# EAGLE design Servant (EAGLE 8.2.2)
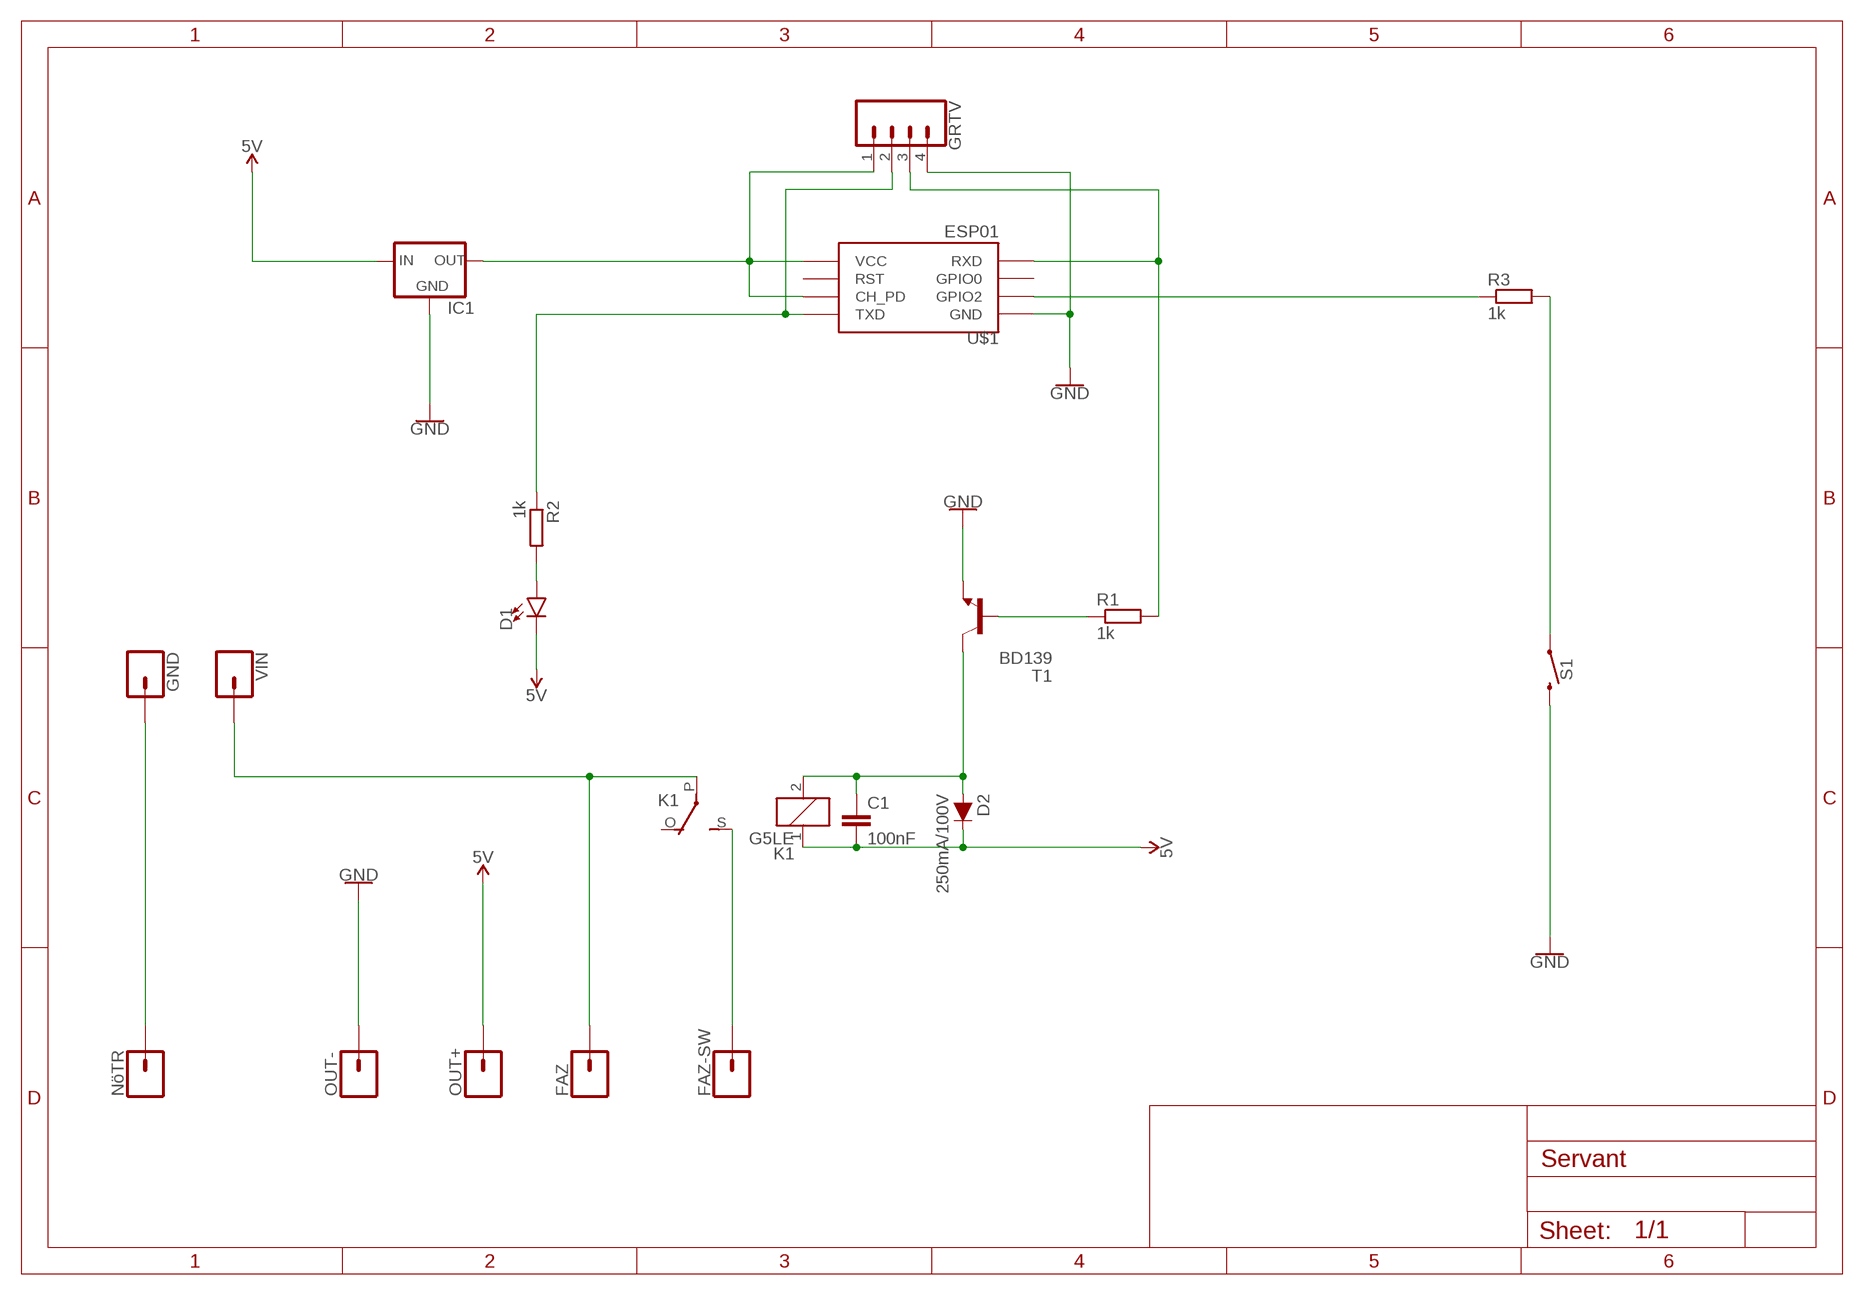
[diagram p0: schematic, sheet 1]

## Parts
C1  100nF  22UF-0805-6.3V-20%  [0805]
D1  LED-3MM-NO_SILK  [LED_3MM-NS]
D2  250mA/100V  DIODE-BAS16J  [SOD-323]
FAZ  CONN_01PTH_LONGPAD  [1X01_LONGPAD]
FAZ-SW  CONN_01PTH_LONGPAD  [1X01_LONGPAD]
GND  CONN_01  [1X01]
GRTV  CONN_041X04_NO_SILK  [1X04_NO_SILK]
IC1  XC63FPM  [SOT23]
K1  G5LE  [G5LE]
NöTR  CONN_01PTH_LONGPAD  [1X01_LONGPAD]
OUT+  CONN_01  [1X01]
OUT-  CONN_01  [1X01]
R1  1k  R-EU_R1206  [R1206]
R2  1k  R-EU_R1206  [R1206]
R3  1k  R-EU_R1206  [R1206]
S1  MOMENTARY-SWITCH-SPST-PTH-6.0MM  [TACTILE_SWITCH_PTH_6.0MM]
T1  BD139  -NPN-TO126V  [TO126V]
U$1  ESP01  [ESP01]
VIN  CONN_01  [1X01]

## Nets
5V: C1.2 D1.K(C) D2.C IC1.3(IN) K1.1 OUT+.1
GND: GRTV.4 IC1.1(GND) OUT-.1 S1.3 T1.1(E) U$1.GND
N$1: GRTV.1 IC1.2(OUT) U$1.CH_PD U$1.VCC
N$2: C1.1 D2.A K1.2 T1.2(C)
N$3: R1.1 T1.3(B)
N$4 [power]: FAZ.1 K1.P(2:P) VIN.1
N$5 [power]: FAZ-SW.1 K1.S(2:S)
N$6: GRTV.3 R1.2 U$1.RX(RXD)
N$7: D1.A R2.2
N$8: GRTV.2 R2.1 U$1.TX(TXD)
N$9 [power]: GND.1 NöTR.1
N$10: R3.1 U$1.GPIO2
N$11: R3.2 S1.1
Unconnected: K1.O(2:O) U$1.GPIO0 U$1.RST

## Library data of the parts
C1 = SparkFun-Capacitors:22UF: 22µF ceramic capacitors A capacitor is a passive two-terminal electrical component used to store electrical energy temporarily in an electric field.; PROD_ID: CAP-08402; VALUE: 22uF
D1 = SparkFun-LED:LED: LED (Generic) Standard schematic elements and footprints for 5mm, 3mm, 1206, and 0603 sized LEDs. Generic LEDs with no color specified.
D2 = SparkFun-DiscreteSemi:DIODE: Diode These are standard reverse protection diodes and small signal diodes. SparkFun Products: SparkFun SparkPunk Sound Kit <https://www.sparkfun.com/products/11177> SparkFun ESP8266 Thing <https://www.sparkfun.com/products/13231>; PROD_ID: DIO-09646
FAZ FAZ-SW GND NöTR OUT+ OUT- VIN = SparkFun-Connectors:CONN_01: Single connection point. Often used as Generic Header-pin footprint for 0.1 inch spaced/style header connections On any of the 0.1 inch spaced packages, you can populate with these: Break Away Headers - Straight <https://www.sparkfun.com/products/116> (PRT-00116) Break Away Male Headers - Right Angle <https://www.sparkfun.com/products/553> (PRT-00553) Female Headers <https://www.sparkfun.com/products/115> (PRT-00115) Break Away Headers - Machine Pin <https://www.sparkfun.com/products/117> (PRT-00117) Break Away Female Headers - Swiss Machine Pin <https://www.sparkfun.com/products/743> (PRT-00743) This device is also useful as a general connection point to wire up your design to another part of your project. Our various solder wires solder well into these plated through hole pads. Hook-Up Wire - Assortment (Stranded, 22 AWG) <https://www.sparkfun.com/products/11375> (PRT-11375) Hook-Up Wire - Assortment (Solid Core, 22 AWG) <https://www.sparkfun.com/products/11367> (PRT-11367) View the entire wire category on our website here <https://www.sparkfun.com/categories/141> Special notes: SMTSO-256-ET is a "flush mount" nut for a 4-40 screw. We mostly use this on specialty testbeds; it is a nice way to connect hardware to your PCB at an adjustable hieght. Also note, the SNAP packages are for using a snappable style connector. We sell a baggie of snaps and they are also used on two LilyPad designs: Snap Assortment - 30 pack (male and female) <https://www.sparkfun.com/products/11347> (DEV-11347) LilyPad Arduino SimpleSnap <https://www.sparkfun.com/products/10941> (DEV-10941) LilyPad SimpleSnap Protoboard <https://www.sparkfun.com/products/10940> (DEV-10940)
GRTV = SparkFun-Connectors:CONN_04: Multi connection point. Often used as Generic Header-pin footprint for 0.1 inch spaced/style header connections On any of the 0.1 inch spaced packages, you can populate with these: Break Away Headers - Straight <https://www.sparkfun.com/products/116> (PRT-00116) Break Away Male Headers - Right Angle <https://www.sparkfun.com/products/553> (PRT-00553) Female Headers <https://www.sparkfun.com/products/115> (PRT-00115) Break Away Headers - Machine Pin <https://www.sparkfun.com/products/117> (PRT-00117) Break Away Female Headers - Swiss Machine Pin <https://www.sparkfun.com/products/743> (PRT-00743) For SCREWTERMINALS and SPRING TERMINALS visit here: Screw Terimnals on SparkFun.com <https://www.sparkfun.com/search/results?term=Screw+Terminals> (5mm/3.5mm/2.54mm spacing) This device is also useful as a general connection point to wire up your design to another part of your project. Our various solder wires solder well into these plated through hole pads. Hook-Up Wire - Assortment (Stranded, 22 AWG) <https://www.sparkfun.com/products/11375> (PRT-11375) Hook-Up Wire - Assortment (Solid Core, 22 AWG) <https://www.sparkfun.com/products/11367> (PRT-11367) View the entire wire category on our website here <https://www.sparkfun.com/categories/141> Special notes: Molex polarized connector foot print use with SKU : PRT-08231 with associated crimp pins and housings. 1MM SMD Version SKU: PRT-10208; PROD_ID: CONN-09696
IC1 = v-reg:XC63FP: Positiv Voltage Regulators www.torex.co.jp/english/product/pro02/pdf/0201_xc62fp.pdf
K1 = relay:G5LE: RELAY 1 x switch, 10 A/120 V AC, 8 A/30 V DC, Omron; OC_FARNELL: unknown; OC_NEWARK: unknown
R1-R3 = resistor:R-EU_: RESISTOR, European symbol
S1 = SparkFun-Switches:MOMENTARY-SWITCH-SPST: Momentary Switch (Pushbutton) - SPST Normally-open (NO) SPST momentary switches (buttons, pushbuttons). Variants PTH-12MM - 12mm square, through-hole Momentary Pushbutton Switch - 12mm Square <https://www.sparkfun.com/products/9190> (COM-09190) PTH-6.0MM, PTH-6.0MM-KIT - 6.0mm square, through-hole Mini Pushbutton Switch <https://www.sparkfun.com/products/97> (COM-00097) KIT package intended for soldering kit's - only one side of pads' copper is exposed. PTH-RIGHT-ANGLE-KIT - Right-angle, through-hole Right Angle Tactile Button <https://www.sparkfun.com/products/10791> - Used on SparkFun BigTime Watch Kit <https://www.sparkfun.com/products/11734> SMD-12MM - 12mm square, surface-mount Tactile Button - SMD (12mm) <https://www.sparkfun.com/products/12993> (COM-12993) Used on SparkFun PicoBoard <https://www.sparkfun.com/products/11888> SMD-4.5MM - 4.5mm Square Trackball Switch Used on SparkFun Blackberry Trackballer Breakout <https://www.sparkfun.com/products/13169> SMD-4.6MMX2.8MM - 4.60mm x 2.80mm, surface mount Used on SparkFun SAMD21 Mini Breakout <https://www.sparkfun.com/products/13664> SMD-5.2MM, SMD-5.2-REDUNDANT - 5.2mm square, surface-mount Mini Pushbutton Switch - SMD <https://www.sparkfun.com/products/8720> (COM-08720) Used on Arduino Pro Mini <https://www.sparkfun.com/products/11114> REDUNDANT package connects both switch circuits together SMD-6.0X3.5MM - 6.0 x 3.5mm, surface mount Momentary Reset Switch SMD <https://www.sparkfun.com/products/8229> (COM-08229) SMD-6.2MM-TALL - 6.2mm square, surface mount Tactile Button - SMD (6mm) <https://www.sparkfun.com/products/12992> Used on SparkFun Digital Sandbox <https://www.sparkfun.com/products/12651> SMD-RIGHT-ANGLE - Right-angle, surface mount Used on SparkFun Block for Intel® Edison - Arduino <https://www.sparkfun.com/products/13036>; PROD_ID: SWCH-08441; SF_SKU: COM-00097
T1 = transistor-neu-to92:*-NPN-: NPN Transistror
U$1 = esp8266modules:ESP01: ESP8266 Wifi module 01

## Net classes
0 default: width 0.127 mm, clearance 0.254 mm
1 power: width 1.016 mm, clearance 0.254 mm

## Board
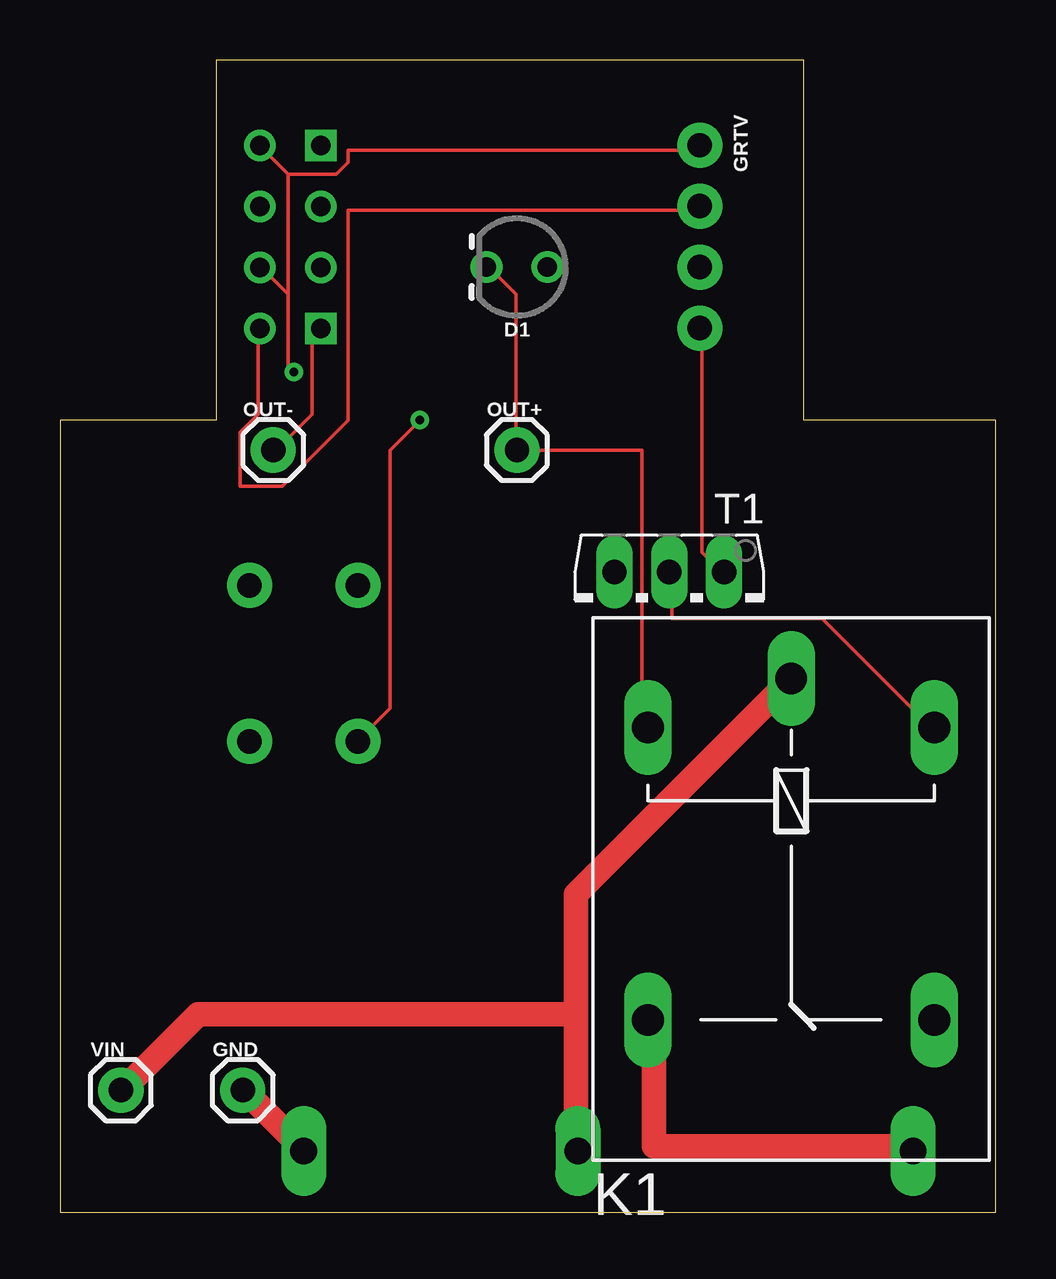
[diagram p1: board, top side]
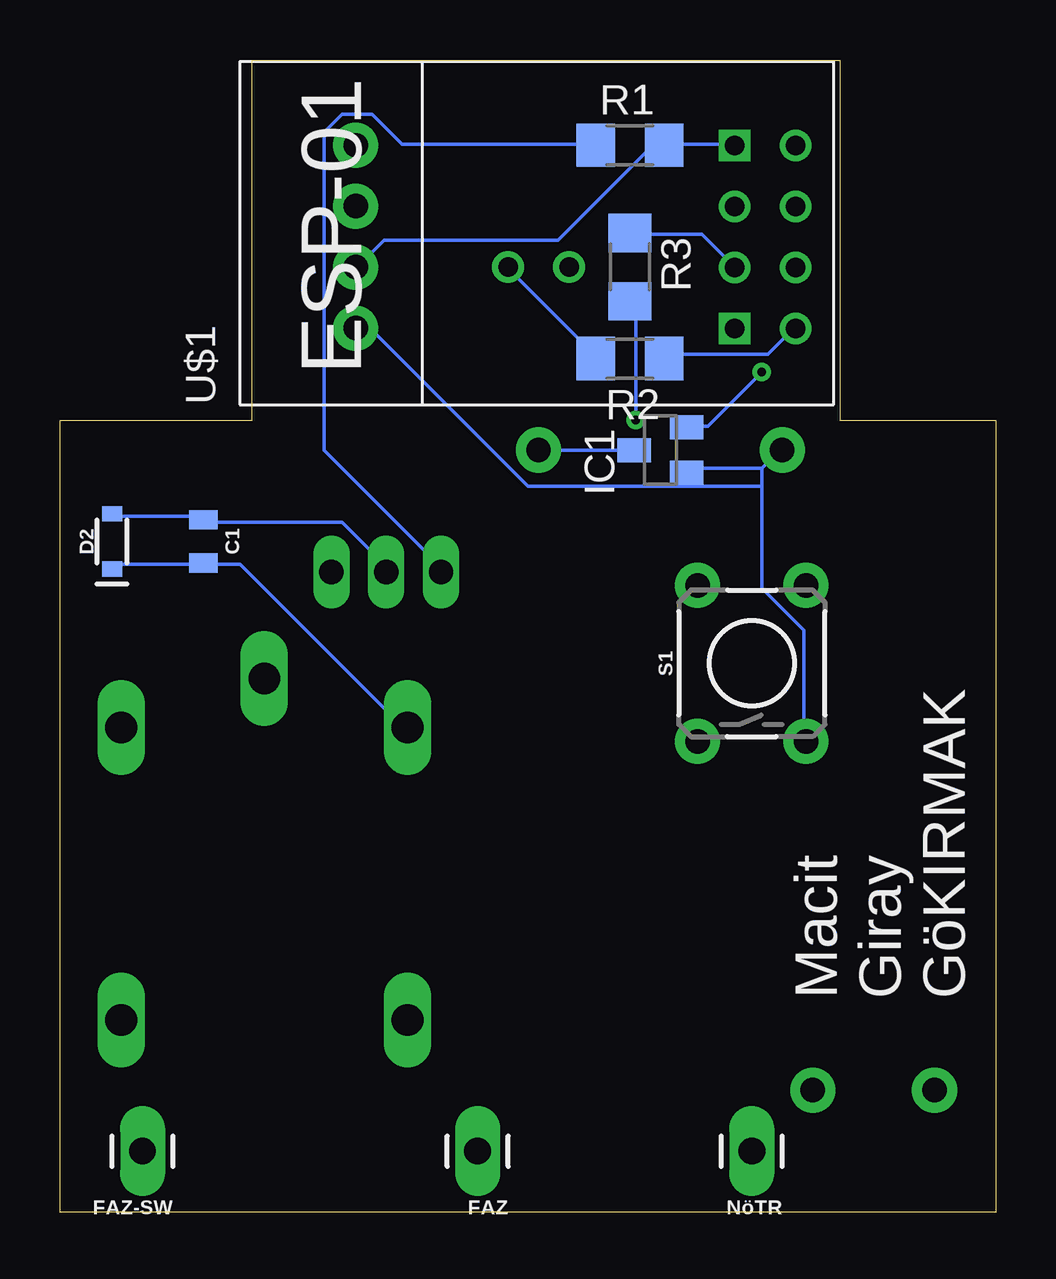
[diagram p2: board, bottom side, seen from below]

Size 39 x 48 mm. Coordinates in mm from the lower left corner, seen from the top.
Outline: 0,0 39,0 39,33 31,33 31,48 6.5,48 6.5,33 0,33 0,0
Copper layers (1*16): Top 0.035mm / dielectric 1.5mm / Bottom 0.035mm
Design rules "default": minimum track width 6mil, minimum drill 0.35mm, track to track 6mil, track to pad 6mil, pad to pad 6mil, via to via 6mil, smd to smd 6mil, copper to edge 40mil, drill to drill 6mil, minimum pad ring 10mil, minimum via ring 8mil, stop-mask expansion 4mil, vias tented up to drill 0mil, thermal gap 10mil

### Footprints (pad centres in the part's own frame; a part is rotated, then mirrored left to right if it is on the bottom)
0805 = smd 0.8 x 1.2: 1 -0.9,0; 2 0.9,0
LED_3MM-NS = drill 0.813: A -1.27,0; K 1.27,0
SOD-323 = smd 0.63 x 0.83: A 1.15,0; C -1.15,0
1X01_LONGPAD = drill 1.118 pad 1.88 long: 1 0,0
1X01 = drill 1.016 pad 1.88: 1 0,0
1X04_NO_SILK = drill 1.016 pad 1.88: 1 0,0; 2 2.54,0; 3 5.08,0; 4 7.62,0
SOT23 = smd 1 x 1.4: 1 -0.95,-1.1; 2 0.95,-1.1; 3 0,1.1
G5LE = drill 1.321 long: 1 -7.493,-5.969; 2 -7.493,5.969; O 4.699,5.969; P -9.525,0; S 4.699,-5.969
R1206 = smd 1.6 x 1.803: 1 -1.422,0; 2 1.422,0
TACTILE_SWITCH_PTH_6.0MM = drill 1.016 pad 1.88: 1 -3.251,2.261; 2 3.251,2.261; 3 -3.251,-2.261; 4 3.251,-2.261
TO126V = drill 1.016 long: 1 -2.286,-1.27; 2 0,-1.27; 3 2.286,-1.27
ESP01 = drill 0.8: CH_PD -1.285,-8.178; GPIO0 1.255,-5.638; GPIO2 -1.285,-5.638; RST 1.255,-8.178; TX -3.825,-8.178; VCC 3.795,-8.178 | drill 0.8 square: GND -3.825,-5.638; RX 3.795,-5.638

### Placement (x,y rotation side)
C1  33.02,27.94 270 bottom
D1  19.05,39.37 180 top
D2  36.83,27.94 90 bottom
FAZ  21.59,2.54 180 bottom
FAZ-SW  35.56,2.54 180 bottom
GND  7.62,5.08 0 top
GRTV  26.67,44.45 270 top
IC1  13.97,31.75 90 bottom
K1  30.48,12.7 270 top
NöTR  10.16,2.54 180 bottom
OUT+  19.05,31.75 0 top
OUT-  8.89,31.75 0 top
R1  15.24,44.45 0 bottom
R2  15.24,35.56 180 bottom
R3  15.24,39.37 270 bottom
S1  10.16,22.86 90 bottom
T1  25.4,25.4 180 top
U$1  16.51,40.64 90 bottom
VIN  2.54,5.08 0 top

### Tracks (layer width: path | path; a pad name or v marks a point on that pad's centre or on a via)
5V
  Top 0.152: D1.K 18,39.25 19,38.25 19,31.75 OUT+.1 24.25,31.75 24.25,20.5 24.5,20.25 K1.1
  Bottom 0.152: OUT+.1 IC1.3 | D2.C 36.75,27 33.25,27 C1.2 33,27 31.5,27 24.75,20.25 K1.1
GND
  Top 0.152: T1.1 27.5,26.75 26.75,27.5 26.75,36.75 GRTV.4 | U$1.GND 10.75,36.75 10.5,36.5 10.5,33.25 9,31.75 OUT-.1
  Bottom 0.152: 9.75,31 12.75,31 IC1.1 | 9.75,31 9,31.75 OUT-.1 | 9.75,31 9.75,30.25 | 9.75,30.25 9.75,26 8,24.25 8,19.75 S1.3 | 9.75,30.25 19.5,30.25 26,36.75 26.5,36.75 GRTV.4
N$1  (via drill 0.35)
  Top 0.152: v9.75,35 9.5,35.25 9.5,38.25 | 9.5,38.25 8.5,39.25 U$1.CH_PD | 9.5,43.25 8.5,44.25 U$1.VCC | 9.5,38.25 9.5,43.25 | 9.5,43.25 11.5,43.25 12,43.75 12,44.25 26.5,44.25 GRTV.1
  Bottom 0.152: v9.75,35 12,32.75 12.75,32.75 IC1.2
N$2
  Top 0.152: K1.2 36.25,20.25 31.75,24.75 25.5,24.75 25.5,26.5 T1.2
  Bottom 0.152: D2.A 36.75,29 33.25,29 C1.1 33,28.75 27.25,28.75 25.25,26.75 T1.2
N$3
  Bottom 0.152: R1.1 16.75,44.5 24.75,44.5 26,45.75 27.25,45.75 28,45 28,31.75 23,26.75 T1.3
N$4
  Top 1.016: 21.5,8.25 5.75,8.25 2.75,5.25 VIN.1 | 21.5,8.25 21.5,2.75 FAZ.1 | 21.5,8.25 21.5,13.25 30.25,22 K1.P
N$5
  Top 1.016: FAZ-SW.1 35.5,2.75 24.75,2.75 24.75,8 K1.S
N$6
  Bottom 0.152: U$1.RX 11,44.5 13.75,44.5 R1.2 14,44.25 14.5,44.25 18.25,40.5 25.5,40.5 26.5,39.5 GRTV.3
N$7
  Bottom 0.152: R2.2 16.75,35.75 20.25,39.25 D1.A
N$8
  Top 0.152: GRTV.2 26.5,41.75 12,41.75 12,33 9.25,30.25 7.5,30.25 7.5,32.5 8.25,33.25 8.25,36.75 U$1.TX
  Bottom 0.152: R2.1 13.75,35.75 9.5,35.75 8.5,36.75 U$1.TX
N$9
  Top 1.016: NöTR.1 10,2.75 7.75,5 GND.1
N$10
  Bottom 0.152: R3.1 15,40.75 12.25,40.75 11,39.5 U$1.GPIO2
N$11  (via drill 0.35)
  Top 0.152: v15,33 13.75,31.75 13.75,21 12.5,19.75 S1.1
  Bottom 0.152: v15,33 15,37.75 R3.2

### Text on the board
_bsilk: Macit / Giray / GöKIRMAK